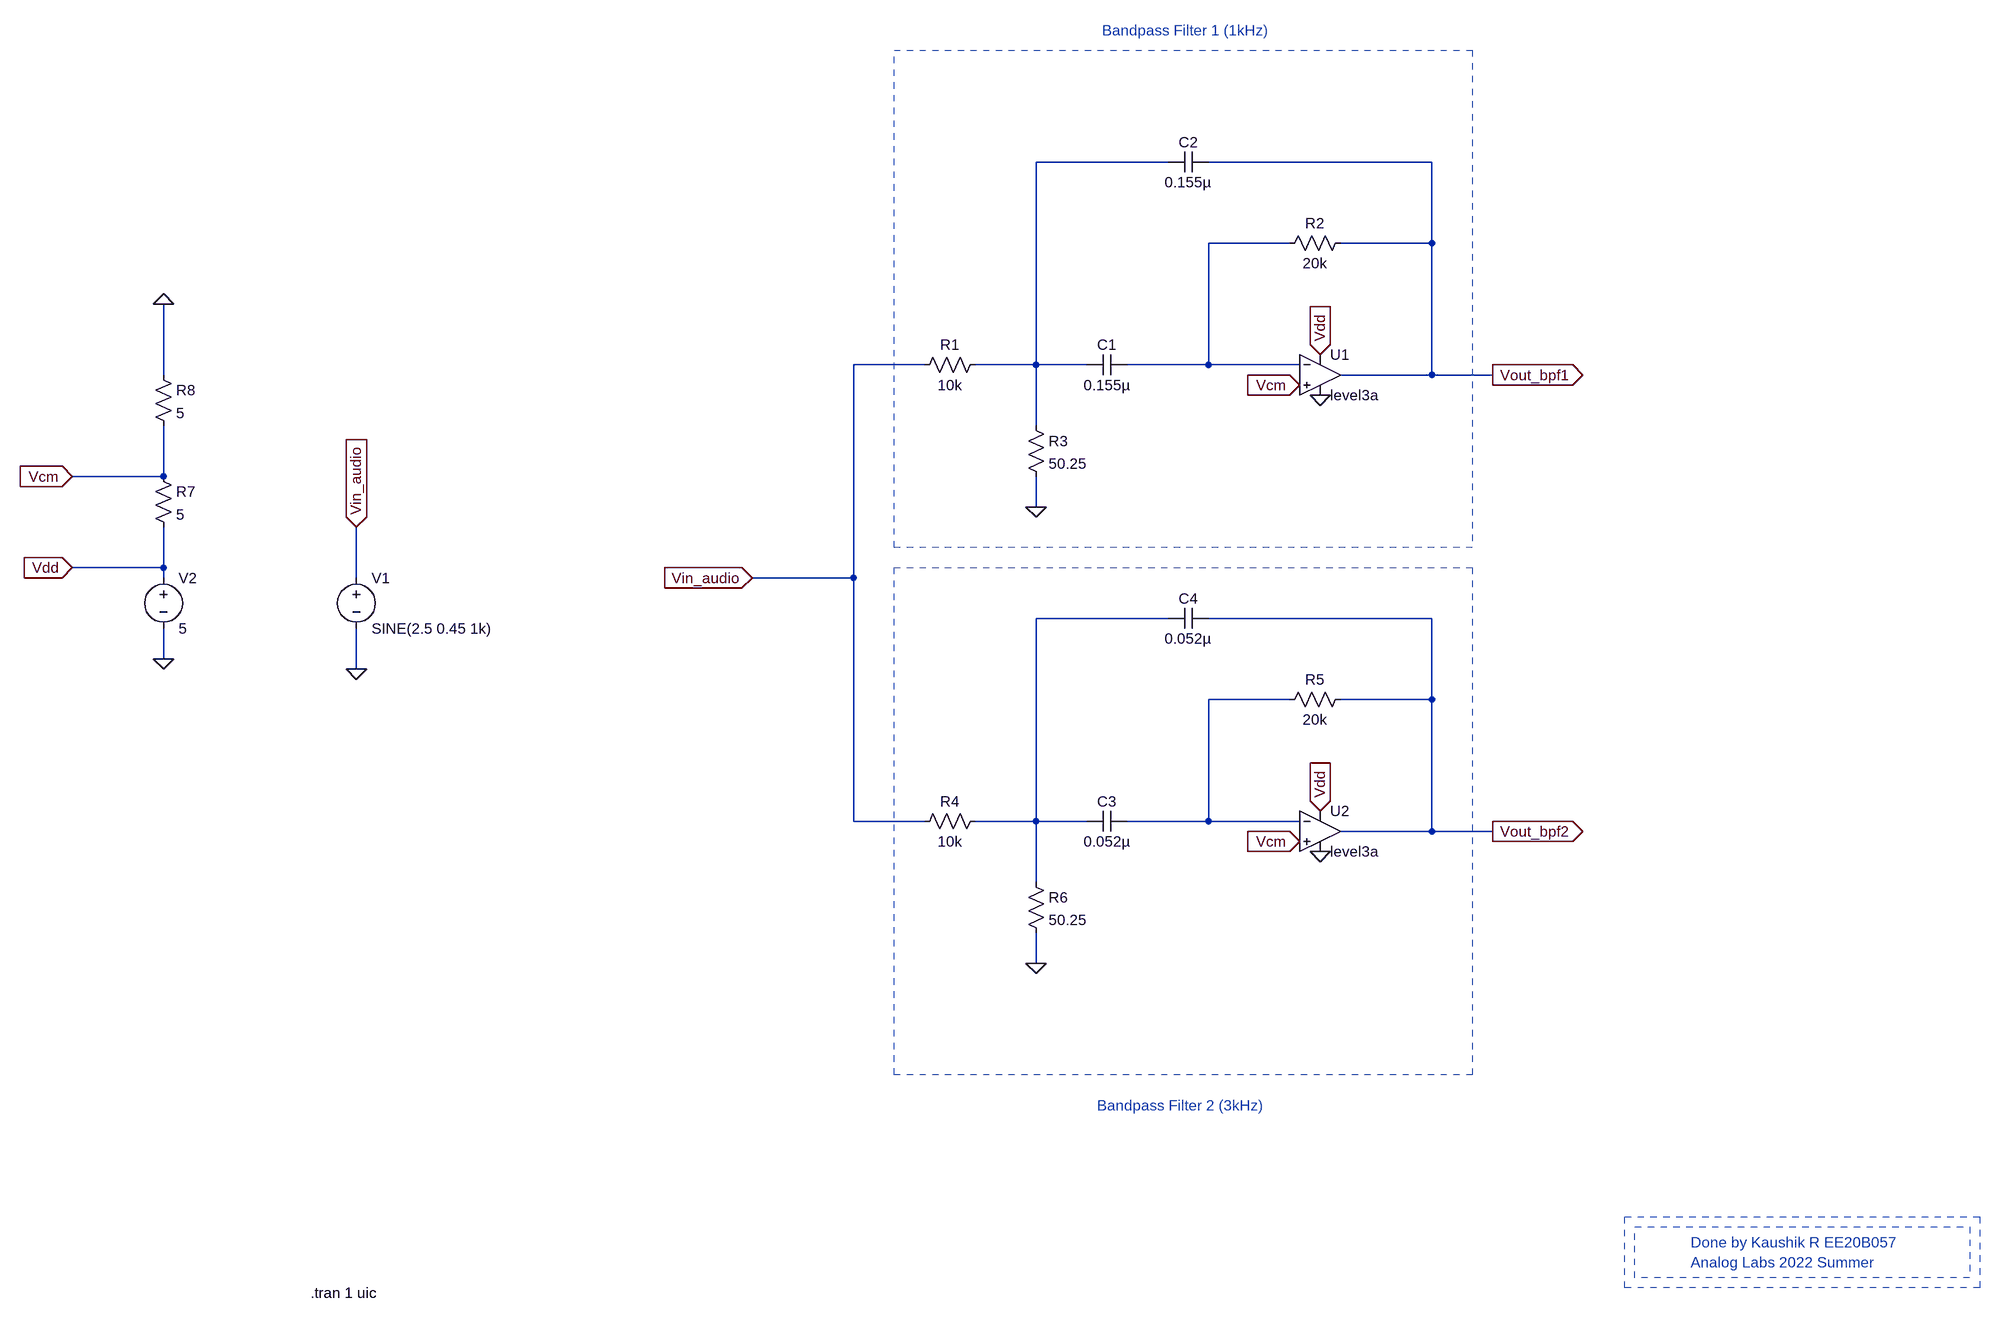
[diagram p0: schematic Exp_6_Simulation.asc]
Exp_6_Simulation.asc, the LTspice schematic file:
Version 4
SHEET 1 2004 1448
WIRE 720 -352 512 -352
WIRE 1136 -352 784 -352
WIRE 912 -224 784 -224
WIRE 1136 -224 1136 -352
WIRE 1136 -224 992 -224
WIRE 336 -32 224 -32
WIRE 512 -32 512 -352
WIRE 512 -32 416 -32
WIRE 592 -32 512 -32
WIRE 784 -32 784 -224
WIRE 784 -32 656 -32
WIRE 928 -32 784 -32
WIRE -864 -16 -864 -128
WIRE 1136 -16 1136 -224
WIRE 1136 -16 992 -16
WIRE 1232 -16 1136 -16
WIRE 512 64 512 -32
WIRE -864 144 -864 64
WIRE -864 144 -1008 144
WIRE 512 192 512 144
WIRE -864 288 -864 224
WIRE -864 288 -1008 288
WIRE -864 304 -864 288
WIRE -560 304 -560 224
WIRE 224 304 224 -32
WIRE 224 304 64 304
WIRE 720 368 512 368
WIRE 1136 368 784 368
WIRE -864 432 -864 384
WIRE -560 448 -560 384
WIRE 912 496 784 496
WIRE 1136 496 1136 368
WIRE 1136 496 992 496
WIRE 224 688 224 304
WIRE 336 688 224 688
WIRE 512 688 512 368
WIRE 512 688 416 688
WIRE 592 688 512 688
WIRE 784 688 784 496
WIRE 784 688 656 688
WIRE 928 688 784 688
WIRE 1136 704 1136 496
WIRE 1136 704 992 704
WIRE 1232 704 1136 704
WIRE 512 784 512 688
WIRE 512 912 512 864
FLAG 1232 -16 Vout_bpf1
IOPIN 1232 -16 Out
FLAG 512 192 0
FLAG 1232 704 Vout_bpf2
IOPIN 1232 704 Out
FLAG 512 912 0
FLAG 64 304 Vin_audio
IOPIN 64 304 In
FLAG -560 448 0
FLAG -560 224 Vin_audio
IOPIN -560 224 In
FLAG 960 -48 Vdd
IOPIN 960 -48 In
FLAG 960 672 Vdd
IOPIN 960 672 In
FLAG 960 16 0
FLAG 960 736 0
FLAG 928 0 Vcm
IOPIN 928 0 In
FLAG 928 720 Vcm
IOPIN 928 720 In
FLAG -864 432 0
FLAG -864 -128 0
FLAG -1008 288 Vdd
IOPIN -1008 288 In
FLAG -1008 144 Vcm
IOPIN -1008 144 In
SYMBOL res 432 -48 R90
WINDOW 0 0 56 VBottom 2
WINDOW 3 32 56 VTop 2
SYMATTR InstName R1
SYMATTR Value 10k
SYMBOL cap 656 -48 R90
WINDOW 0 0 32 VBottom 2
WINDOW 3 32 32 VTop 2
SYMATTR InstName C1
SYMATTR Value 0.155µ
SYMBOL res 1008 -240 R90
WINDOW 0 0 56 VBottom 2
WINDOW 3 32 56 VTop 2
SYMATTR InstName R2
SYMATTR Value 20k
SYMBOL res 496 48 R0
SYMATTR InstName R3
SYMATTR Value 50.25
SYMBOL cap 784 -368 R90
WINDOW 0 0 32 VBottom 2
WINDOW 3 32 32 VTop 2
SYMATTR InstName C2
SYMATTR Value 0.155µ
SYMBOL res 432 672 R90
WINDOW 0 0 56 VBottom 2
WINDOW 3 32 56 VTop 2
SYMATTR InstName R4
SYMATTR Value 10k
SYMBOL cap 656 672 R90
WINDOW 0 0 32 VBottom 2
WINDOW 3 32 32 VTop 2
SYMATTR InstName C3
SYMATTR Value 0.052µ
SYMBOL res 1008 480 R90
WINDOW 0 0 56 VBottom 2
WINDOW 3 32 56 VTop 2
SYMATTR InstName R5
SYMATTR Value 20k
SYMBOL res 496 768 R0
SYMATTR InstName R6
SYMATTR Value 50.25
SYMBOL cap 784 352 R90
WINDOW 0 0 32 VBottom 2
WINDOW 3 32 32 VTop 2
SYMATTR InstName C4
SYMATTR Value 0.052µ
SYMBOL voltage -560 288 R0
WINDOW 123 0 0 Left 0
WINDOW 39 0 0 Left 0
SYMATTR InstName V1
SYMATTR Value SINE(2.5 0.45 1k)
SYMBOL OpAmps\\UniversalOpAmp3 960 -16 R0
SYMATTR InstName U1
SYMBOL OpAmps\\UniversalOpAmp3 960 704 R0
SYMATTR InstName U2
SYMBOL voltage -864 288 R0
WINDOW 123 0 0 Left 0
WINDOW 39 0 0 Left 0
SYMATTR InstName V2
SYMATTR Value 5
SYMBOL res -880 128 R0
SYMATTR InstName R7
SYMATTR Value 5
SYMBOL res -880 -32 R0
SYMATTR InstName R8
SYMATTR Value 5
TEXT 616 -560 Left 2 ;Bandpass Filter 1 (1kHz)
TEXT 608 1136 Left 2 ;Bandpass Filter 2 (3kHz)
TEXT 1544 1352 Left 2 ;Done by Kaushik R EE20B057
TEXT 1544 1384 Left 2 ;Analog Labs 2022 Summer
TEXT -632 1432 Left 2 !.tran 1 uic
RECTANGLE Normal 1200 256 288 -528 2
RECTANGLE Normal 1200 1088 288 288 2
RECTANGLE Normal 2000 1424 1440 1312 2
RECTANGLE Normal 1984 1408 1456 1328 2

The netlist it stands for:
* Exp_6_Simulation.asc
R1 N001 Vin_audio 10k
C1 N002 N001 0.155µ
R2 Vout_bpf1 N002 20k
R3 N001 0 50.25
C2 Vout_bpf1 N001 0.155µ
R4 N003 Vin_audio 10k
C3 N004 N003 0.052µ
R5 Vout_bpf2 N004 20k
R6 N003 0 50.25
C4 Vout_bpf2 N003 0.052µ
V1 Vin_audio 0 SINE(2.5 0.45 1k)
XU1 Vcm N002 Vdd 0 Vout_bpf1 level3a  ; pins In+ In- V+ V- OUT
XU2 Vcm N004 Vdd 0 Vout_bpf2 level3a  ; pins In+ In- V+ V- OUT
V2 Vdd 0 5
R7 Vcm Vdd 5
R8 0 Vcm 5
* Bandpass Filter 1 (1kHz)
* Bandpass Filter 2 (3kHz)
* Done by Kaushik R EE20B057
* Analog Labs 2022 Summer
.tran 1 uic
.backanno
.end